# Altium schematic sheet USB3.SchDoc (part 2 of 2)
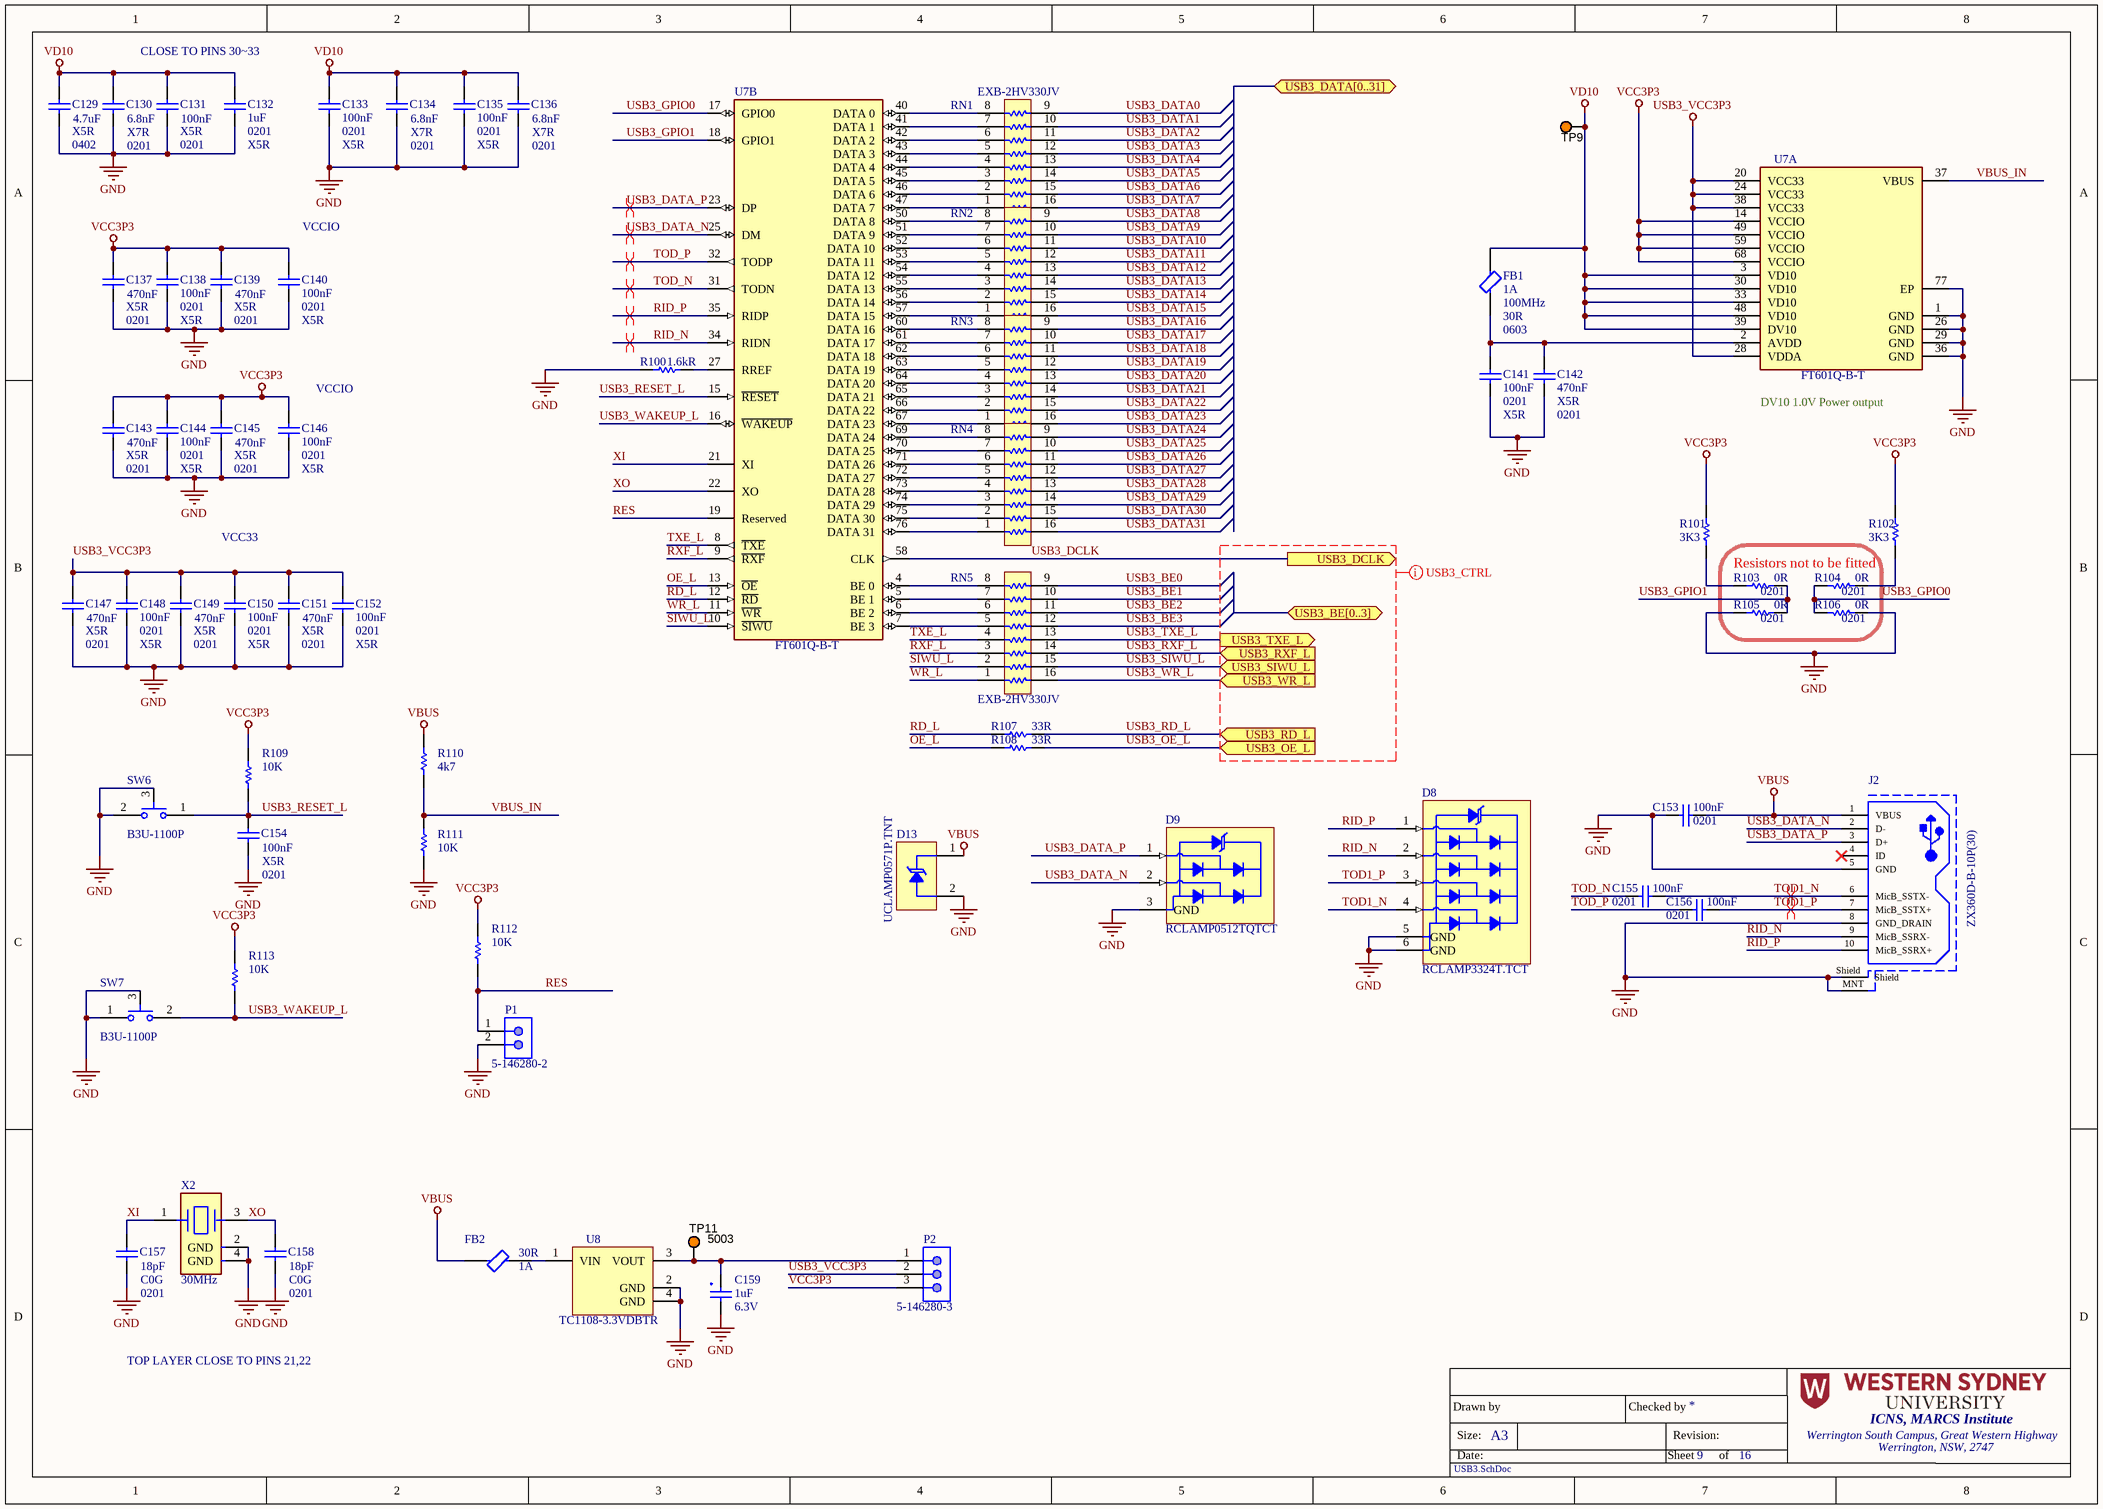
[diagram p1: USB3.SchDoc]

## Library data of the parts
C129 = CMP-003-000024-1: Cap Multilayer Ceramic 4.7uF 10 V X5R ±10 % SMT 0402  C Series; Manufacturer: TDK; Voltage Rating: 10V; Tolerance: 10%; Value: 4.7uF; ComponentLink2Description: https://datasheet.ciiva.com/14895/tdkmlcccaprange-14895671.pdf?src-supplier=Digi-Key; Manufacturer Part Number: C1005X5R1A475K050BC; Category: Ceramic Capacitors; ComponentLink2URL: https://datasheet.ciiva.com/14895/tdkmlcccaprange-14895671.pdf?src-supplier=Digi-Key; Lead Free: Lead Free; RoHS: Yes; Thickness: 0.022inch; Package Quantity: 10000; ComponentLink1URL: https://datasheet.ciiva.com/14895/tdkmlcccaprange-14895670.pdf?src-supplier=Digi-Key; ComponentLink3Description: https://datasheet.ciiva.com/14895/tdkmlcccaprange-14895672.pdf?src-supplier=Digi-Key; Case/Package: 0402; REACH SVHC: No SVHC; ComponentLink1Description: https://datasheet.ciiva.com/14895/tdkmlcccaprange-14895670.pdf?src-supplier=Digi-Key; Length: 0.039inch; Max Operating Temperature: 85°C; Series: C; ComponentLink3URL: https://datasheet.ciiva.com/14895/tdkmlcccaprange-14895672.pdf?src-supplier=Digi-Key; Voltage Rating (DC): 10V; Min Operating Temperature: -55°C; Width: 0.02inch; Stock 1: 490145; Source: ICNS_PropheseeLib.SchLib; Pricing 1: 1=0.48000, 10=0.33000, 50=0.23100, 100=0.19800, 500=0.14850, 1000=0.12540, 2500=0.11880, 5000=0.11220 (USD); Design Item ID: C1005X5R1A475K050BC; Dielectric Material: Ceramic; Mount: Surface Mount; Packaging: Cut Tape; Case Code (Metric): 1005
C130 C134 C136 = CMP-003-000023-2: Cap Multilayer Ceramic 6.8nF 10V X7R SMT 0201 ±10% Tolerance; Manufacturer: Murata; Voltage Rating: 10V; Value: 6.8nF; Tolerance: 10%; Max Operating Temperature: 125°C; Case/Package: 0201; Min Operating Temperature: -55°C; ComponentLink9URL: https://datasheet.ciiva.com/11619/product-11619829.pdf?src-supplier=Avnet; ComponentLink9Description: https://datasheet.ciiva.com/11619/product-11619829.pdf?src-supplier=Avnet; Manufacturer Part Number: GRM033R71A682KA01D; ComponentLink7Description: https://datasheet.ciiva.com/6068/482872-6068141.pdf?src-supplier=Farnell; Depth: 0.3mm; ComponentLink7URL: https://datasheet.ciiva.com/6068/482872-6068141.pdf?src-supplier=Farnell; Thickness: 0.013inch; REACH SVHC: No SVHC; ComponentLink3Description: https://datasheet.ciiva.com/130/grm033r71a682ka01-01-130329.pdf?src-supplier=Digi-Key; Stock 1: 373159; Pricing 1: 1=0.10000, 10=0.02500, 50=0.01380, 100=0.01130, 500=0.00808, 1000=0.00635, 2500=0.00578, 5000=0.00531 (USD); Lead Free: Lead Free; Packaging: Tape and Reel; Length: 0.6mm; ComponentLink6Description: https://datasheet.ciiva.com/6068/482872-6068139.pdf?src-supplier=Farnell; Mount: Surface Mount; ComponentLink6URL: https://datasheet.ciiva.com/6068/482872-6068139.pdf?src-supplier=Farnell; Radiation Hardening: No; Source: ICNS_PropheseeLib.SchLib; ComponentLink2Description: https://datasheet.ciiva.com/130/grm033r71a682ka01-01-130327.pdf?src-supplier=Digi-Key; ComponentLink2URL: https://datasheet.ciiva.com/130/grm033r71a682ka01-01-130327.pdf?src-supplier=Digi-Key; Case Code (Metric): 0603; Width: 0.3mm; Termination: SMD/SMT; ComponentLink1URL: https://datasheet.ciiva.com/130/grm033r71a682ka01-01-130328.pdf?src-supplier=Digi-Key; ComponentLink1Description: https://datasheet.ciiva.com/130/grm033r71a682ka01-01-130328.pdf?src-supplier=Digi-Key; Design Item ID: GRM033R71A682KA01D; ComponentLink5URL: https://datasheet.ciiva.com/29199/455752-da-01-en-vs-kondensator-0201-29199157.pdf?src-supplier=Conrad; ComponentLink8Description: https://datasheet.ciiva.com/7937/482872-7937599.pdf?src-supplier=Element14; Voltage Rating (DC): 10V; ComponentLink8URL: https://datasheet.ciiva.com/7937/482872-7937599.pdf?src-supplier=Element14; ComponentLink4Description: https://datasheet.ciiva.com/17453/product-17453281.pdf?src-supplier=Avnet+Europe; Number of Pins: 2; Height: 0.3mm; RoHS: Yes; ComponentLink4URL: https://datasheet.ciiva.com/17453/product-17453281.pdf?src-supplier=Avnet+Europe; ComponentLink3URL: https://datasheet.ciiva.com/130/grm033r71a682ka01-01-130329.pdf?src-supplier=Digi-Key; Package Quantity: 1; ComponentLink5Description: https://datasheet.ciiva.com/29199/455752-da-01-en-vs-kondensator-0201-29199157.pdf?src-supplier=Conrad; Category: Ceramic Capacitors; Material: Ceramic
C131 C133 C135 C138 C140 C141 C144 C146 C148 C150 C152-C156 = CMP-003-000014-1: Cap Ceramic 0.1uF 10V X5R 10% Pad SMD 0201 85C T/R; Manufacturer: Samsung; Voltage Rating: 10V; Tolerance: 10%; Value: 0.1uF; ComponentLink2Description: https://datasheet.ciiva.com/26838/getdatasheetpartid-357484-26838083.pdf?src-supplier=Verical; Manufacturer Part Number: CL03A104KP3NNNC; Category: Ceramic Capacitors; ComponentLink2URL: https://datasheet.ciiva.com/26838/getdatasheetpartid-357484-26838083.pdf?src-supplier=Verical; Lead Free: Lead Free; RoHS: Yes; Thickness: 0.013inch; Package Quantity: 1; ComponentLink1URL: https://datasheet.ciiva.com/25803/cl03a104kp3nnnc-25803204.pdf?src-supplier=Digi-Key; Case/Package: 0201; ComponentLink1Description: https://datasheet.ciiva.com/25803/cl03a104kp3nnnc-25803204.pdf?src-supplier=Digi-Key; Length: 0.6mm; Max Operating Temperature: 85°C; Series: CL; Voltage Rating (DC): 10V; Min Operating Temperature: -55°C; Width: 0.012inch; Stock 1: 12175; Source: ICNS_PropheseeLib.SchLib; Pricing 1: 1=0.10000, 10=0.02900, 50=0.01600, 100=0.01300, 500=0.00932, 1000=0.00732, 2500=0.00666, 5000=0.00612 (USD); Design Item ID: CL03A104KP3NNNC; Mount: Surface Mount; Packaging: Tape and Reel; Case Code (Metric): 0603; Depth: 0.3mm; Radiation Hardening: No; Height: 0.3mm; Contact Plating: Tin; Construction: Flat
  C153 C155 C156: Dielectric: X5R
C132 = CMP-003-000015-1: Cap Ceramic 1uF 10V X5R 10% Pad SMD 0201 85C T/R; Manufacturer: Samsung; Manufacturer Part Number: CL03A105KP3NSNC; RoHS: Yes; Voltage Rating: 10V; Value: 1uF; Tolerance: 10%; Category: Ceramic Capacitors; Source: ICNS_PropheseeLib.SchLib; Mount: Surface Mount; Stock 1: 3449211; Packaging: Cut Tape; ComponentLink1Description: http://www.samsungsem.com/kr/support/product-search/mlcc/CL03A105KP3NSNC.jsp?src-supplier=Digi-Key; Case Code (Metric): 0603; Width: 0.012inch; Length: 0.024inch; Thickness: 0.013inch; Max Operating Temperature: 85°C; Design Item ID: CL03A105KP3NSNC; Case/Package: 0201; Min Operating Temperature: -55°C; Pricing 1: 10000=0.06202, 20000=0.05883 (USD); ComponentLink1URL: http://www.samsungsem.com/kr/support/product-search/mlcc/CL03A105KP3NSNC.jsp?src-supplier=Digi-Key; RoHS Compliant: Yes
C137 C139 C142 C143 C145 C147 C149 C151 = CMP-003-000027-1: Cap Multilayer Ceramic 0.47 uF 10V X5R  0201 10% RoHS  (High dielectric type); Manufacturer: Taiyo Yuden; Value: 470nF; Manufacturer Part Number: LMK063BBJ474KPLF; Category: Ceramic Capacitors; RoHS: Yes; ComponentLink1URL: http://www.farnell.com/datasheets/2820091.pdf?src-supplier=Farnell; ComponentLink1Description: http://www.farnell.com/datasheets/2820091.pdf?src-supplier=Farnell; Voltage Rating (DC): 10V; Stock 1: 12200; Source: ICNS_PropheseeLib.SchLib; Pricing 1: 1=0.22500, 25=0.09300, 100=0.07600, 250=0.06500, 500=0.05400, 1000=0.04400 (USD); Design Item ID: LMK063BBJ474KPLF; RoHS Compliant: Yes
C157 C158 = CMP-003-000016-2: Cap Ceramic 18pF 25V C0G 10% SMD 0201 125°C Paper T/R; Manufacturer: KEMET; Length: 0.024inch; Voltage Rating (DC): 25V; Thickness: 0.013inch; Max Operating Temperature: 125°C; Min Operating Temperature: -55°C; RoHS Compliant: Yes; Package Quantity: 1; Mount: Surface Mount; Case Code (Imperial): 0201; Termination: SMD/SMT; Voltage Rating: 25V; Capacitance: 18pF; Case Code (Metric): 0603; Tolerance: 10%; Packaging: Tape and Reel; Width: 0.012inch; Height: 0.3mm; ComponentLink2Description: https://search.kemet.com/component-edge/download/datasheet/C0201C180K3GACTU.pdf?src-supplier=Digi-Key; ComponentLink1URL: http://www.mouser.com/ds/2/212/KEM_C1003_C0G_SMD-1101588.pdf?src-supplier=Mouser; ComponentLink2URL: https://search.kemet.com/component-edge/download/datasheet/C0201C180K3GACTU.pdf?src-supplier=Digi-Key; Source: ICNS_PropheseeLib.SchLib; RoHS: Yes; Series: C; ComponentLink1Description: http://www.mouser.com/ds/2/212/KEM_C1003_C0G_SMD-1101588.pdf?src-supplier=Mouser; Pricing 1: 1=0.04140, 10=0.02080, 25=0.02070, 100=0.00980, 250=0.00970, 500=0.00700, 1000=0.00680, 3000=0.00660, 6000=0.00640 (USD); Stock 1: 13195; Category: Ceramic Capacitors; Manufacturer Part Number: C0201C180K3GACTU; Design Item ID: C0201C180K3GACTU
C159 = CMP-003-000029-1: Cap Tant Polymer 1uF 6.3VDC U CASE 20%( 1.1 X 0.6 X 0.55mm) Undertab SMD 1106-06 1.5 Ohm 105C T/R; Manufacturer: Kyocera AVX; ESR (Equivalent Series Resistance): 1R5; Mount: Surface Mount; Case Code (Metric): 1106; Category: Polymer Capacitors; Case Code (Imperial): 0402; Manufacturer Part Number: F380J105MUA; Case/Package: 0402; Design Item ID: F380J105MUA; RoHS: Yes; Source: ICNS_PropheseeLib.SchLib; Value: 1uF; RoHS Compliant: Yes; Voltage Rating (DC): 6.3V; Tolerance: 20%; Dielectric: Tant Polymer; Stock 1: 9935; Pricing 1: 1=0.26470, 10=0.24710, 25=0.24460, 100=0.21890, 250=0.21670, 500=0.20320, 1000=0.18950, 3000=0.18420, 6000=0.17850 (USD)
D8 = CMP-024-000001-2: TVS DIODE 3.3VWM 10.5VC; Manufacturer: Semtech; Reverse Standoff Voltage: 3.3V; Number of Bidirectional Channels: 4; Peak Pulse Current: 5A; Power Line Protection: Yes; Min Breakdown Voltage: 3.8V; Clamping Voltage: 10.5V; Peak Pulse Power: 75W; Mount: Surface Mount; Number of Pins: 6; Manufacturer Part Number: RCLAMP3324T.TCT; Max Operating Temperature: 125°C; RoHS Compliant: Yes; Category: TVS Diodes; Pricing 1: 1=0.99000, 10=0.87200, 50=0.87200, 100=0.66800, 500=0.52800, 1000=0.42300, 2500=0.38300, 5000=0.34800, 10000=0.33500 (USD); Design Item ID: RCLAMP3324T.TCT; RoHS: Yes; Packaging: Cut Tape; Min Operating Temperature: -40°C; Source: Falcon_Neuro.SchLib; Stock 1: 58192; Number of Unidirectional Channels: 4; Lead Free: Lead Free; Series: RailClamp®
D9 = CMP-024-000000-1: 8.5V Clamp 20A (1.2/50µs) Ipp Tvs Diode Surface Mount SGP1006N3T; Manufacturer: Semtech; Min Breakdown Voltage: 6.5V; Number of Bidirectional Channels: 2; Reverse Standoff Voltage: 5V; Power Line Protection: Yes; Peak Pulse Power: 170W; ComponentLink6Description: https://www.semtech.com/uploads/documents/rclamp0512tq.pdf?src-supplier=Digi-Key; ComponentLink5Description: http://www.farnell.com/datasheets/2723967.pdf?src-supplier=Newark; ComponentLink3URL: https://media.digikey.com/pdf/Data%20Sheets/Semtech%20PDFs/RCLAMP0512TQ_Rev6_12-17-15.pdf?src-supplier=Digi-Key; RoHS: Yes; Pricing 1: 1=1.03000, 25=0.92000, 50=0.82000, 100=0.71800, 250=0.65500, 500=0.59300 (USD); Stock 1: 2338; Peak Pulse Current: 20A; ComponentLink1Description: http://www.farnell.com/datasheets/2723967.pdf?src-supplier=Farnell; Max Operating Temperature: 125°C; ComponentLink5URL: http://www.farnell.com/datasheets/2723967.pdf?src-supplier=Newark; Design Item ID: RCLAMP0512TQTCT; ComponentLink3Description: https://media.digikey.com/pdf/Data%20Sheets/Semtech%20PDFs/RCLAMP0512TQ_Rev6_12-17-15.pdf?src-supplier=Digi-Key; Min Operating Temperature: -40°C; Source: Falcon_Neuro.SchLib; Packaging: Tape and Reel; ComponentLink1URL: http://www.farnell.com/datasheets/2723967.pdf?src-supplier=Farnell; Manufacturer Part Number: RCLAMP0512TQTCT; ComponentLink4Description: http://www.farnell.com/datasheets/2723967.pdf?src-supplier=Element14; ComponentLink4URL: http://www.farnell.com/datasheets/2723967.pdf?src-supplier=Element14; Category: TVS Diodes; Mount: Surface Mount; ComponentLink2URL: http://www.mouser.com/ds/2/761/down-768395.pdf?src-supplier=Mouser; Number of Pins: 3; RoHS Compliant: Yes; ComponentLink2Description: http://www.mouser.com/ds/2/761/down-768395.pdf?src-supplier=Mouser; Lead Free: Lead Free; ComponentLink6URL: https://www.semtech.com/uploads/documents/rclamp0512tq.pdf?src-supplier=Digi-Key; Clamping Voltage: 8.5V
D13 = CMP-024-000002-2: ESD Suppressor Diode TVS Uni-Dir 5V Automotive 2-Pin SGP T/R; Manufacturer: Semtech; Clamping Voltage: 15V; Peak Pulse Current: 80A; Number of Unidirectional Channels: 1; Power Line Protection: No; Min Breakdown Voltage: 6V; Number of Pins: 2; Design Item ID: UCLAMP0571P.TNT; Packaging: Tape and Reel; ComponentLink2URL: https://media.digikey.com/pdf/Data%20Sheets/~No%20Display/Semtech%20PDFs/uClamp0571P-3671P.pdf?src-supplier=Digi-Key; Max Operating Temperature: 125°C; Stock 1: 16165; RoHS: Yes; Source: Falcon_Neuro.SchLib; Reverse Standoff Voltage: 5V; ComponentLink1Description: http://www.mouser.com/ds/2/761/uclampxx71p_2-779780.pdf?src-supplier=Mouser; Min Operating Temperature: -40°C; ComponentLink1URL: http://www.mouser.com/ds/2/761/uclampxx71p_2-779780.pdf?src-supplier=Mouser; ComponentLink2Description: https://media.digikey.com/pdf/Data%20Sheets/~No%20Display/Semtech%20PDFs/uClamp0571P-3671P.pdf?src-supplier=Digi-Key; Resistor Type: Zener; Mount: Surface Mount; Pricing 1: 1=0.91000, 10=0.79900, 50=0.79900, 100=0.61300, 500=0.48400, 1000=0.38800, 2500=0.35100, 5000=0.31900, 10000=0.30700 (USD); Category: TVS Diodes; Manufacturer Part Number: UCLAMP0571P.TNT
FB1 = CMP-005-000009-1: Ferrite Beads Multi-Layer 30Ohm 100MHz 1A 0.05Ohm DCR 0603 Automotive T/R; Manufacturer: Murata; Shielding: Unshielded; Number of Circuits: 1; Tolerance: 25%; DC Resistance (DCR): 50mR; ComponentLink2URL: http://www.mouser.com/ds/2/281/c31e-522703.pdf?src-supplier=Mouser; Min Operating Temperature: -55°C; ComponentLink3Description: http://search.murata.co.jp/Ceramy/image/img/PDF/ENG/L0132S0193BLM18P.pdf?src-supplier=Avnet; Stock 1: 4110; ComponentLink4URL: https://www.murata.com/en-us/products/productdata/8796738650142/ENFA0003.pdf?src-supplier=Digi-Key; Source: ICNS_PropheseeLib.SchLib; Packaging: Tape and Reel; ComponentLink1URL: http://components.arrow.com/part/dataview/41887707S276346N2606?src-supplier=Arrow+Electronics; Pricing 1: 10=0.07400, 25=0.06700, 50=0.05900, 100=0.05200 (USD); ComponentLink3URL: http://search.murata.co.jp/Ceramy/image/img/PDF/ENG/L0132S0193BLM18P.pdf?src-supplier=Avnet; ComponentLink5URL: http://www.murata.com/en-global/products/productdata/8796733767710/S0580E.pdf?src-supplier=Digi-Key; Contact Plating: Tin,Matte; Design Item ID: BLM18PG300SH1D; RoHS: Yes; RoHS Compliant: Yes; ComponentLink4Description: https://www.murata.com/en-us/products/productdata/8796738650142/ENFA0003.pdf?src-supplier=Digi-Key; Series: EMIFIL®, BLM18P; Max DC Current: 1A; ComponentLink2Description: http://www.mouser.com/ds/2/281/c31e-522703.pdf?src-supplier=Mouser; Ratings: AEC-Q200; Mount: Surface Mount; Category: Ferrite Beads and Chips; Case Code (Metric): 1608; Termination: SMD/SMT; Width: 0.031inch; Package Quantity: 1; Height: 0.037inch; ComponentLink5Description: http://www.murata.com/en-global/products/productdata/8796733767710/S0580E.pdf?src-supplier=Digi-Key; Manufacturer Part Number: BLM18PG300SH1D; Number of Lines: 1; ComponentLink1Description: http://components.arrow.com/part/dataview/41887707S276346N2606?src-supplier=Arrow+Electronics; Case/Package: 0603; Max Operating Temperature: 125°C; Length: 1.6mm
FB2 = CMP-005-000009-1: Ferrite Beads Multi-Layer 30Ohm 100MHz 1A 0.05Ohm DCR 0603 Automotive T/R; Manufacturer: Murata; DC Resistance (DCR): 50mR; Shielding: Unshielded; Tolerance: 25%; Number of Circuits: 1; Case/Package: 0603; ComponentLink1Description: http://components.arrow.com/part/dataview/41887707S276346N2606?src-supplier=Arrow+Electronics; ComponentLink1URL: http://components.arrow.com/part/dataview/41887707S276346N2606?src-supplier=Arrow+Electronics; ComponentLink2Description: http://www.mouser.com/ds/2/281/c31e-522703.pdf?src-supplier=Mouser; ComponentLink2URL: http://www.mouser.com/ds/2/281/c31e-522703.pdf?src-supplier=Mouser; ComponentLink3Description: http://search.murata.co.jp/Ceramy/image/img/PDF/ENG/L0132S0193BLM18P.pdf?src-supplier=Avnet; ComponentLink3URL: http://search.murata.co.jp/Ceramy/image/img/PDF/ENG/L0132S0193BLM18P.pdf?src-supplier=Avnet; ComponentLink4Description: https://www.murata.com/en-us/products/productdata/8796738650142/ENFA0003.pdf?src-supplier=Digi-Key; ComponentLink4URL: https://www.murata.com/en-us/products/productdata/8796738650142/ENFA0003.pdf?src-supplier=Digi-Key; ComponentLink5Description: http://www.murata.com/en-global/products/productdata/8796733767710/S0580E.pdf?src-supplier=Digi-Key; ComponentLink5URL: http://www.murata.com/en-global/products/productdata/8796733767710/S0580E.pdf?src-supplier=Digi-Key; Height: 0.037inch; Length: 1.6mm; Max DC Current: 1A; Max Operating Temperature: 125°C; Min Operating Temperature: -55°C; Mount: Surface Mount; Package Quantity: 1; Packaging: Tape and Reel; Pricing 1: 10=0.07400, 25=0.06700, 50=0.05900, 100=0.05200 (USD); RoHS: Yes; Stock 1: 4110; Termination: SMD/SMT; Test Frequency: 100MHz; Width: 0.031inch; Design Item ID: BLM18PG300SH1D; RoHS Compliant: Yes; Source: ICNS_PropheseeLib.SchLib; Category: Ferrite Beads and Chips; Contact Plating: Tin,Matte; Series: EMIFIL®, BLM18P; Ratings: AEC-Q200; Case Code (Metric): 1608; Case Code (Imperial): 0603; Manufacturer Part Number: BLM18PG300SH1D; Number of Lines: 1
J2 = CMP-010-000019-1: Conn Micro USB 3.0 Type B F 10 POS 0.65mm Solder RA SMD 10 Terminal 1 Port T/R; Manufacturer: Hirose; Gender: Receptacle; Number of Contacts: 10; USB Standard: USB 3.0; Connector Type: USB; Packaging: Tape and Reel; Orientation: Right Angle; ComponentLink1URL: http://www.farnell.com/datasheets/2691175.pdf?src-supplier=Farnell; Pricing 1: 1=1.45000, 10=1.18000, 50=1.18000, 100=1.12000, 250=1.01000, 500=0.93900, 1000=0.80400, 3000=0.72800, 10000=0.72800 (USD); Stock 1: 15785; ComponentLink1Description: http://www.farnell.com/datasheets/2691175.pdf?src-supplier=Farnell; ComponentLink2URL: https://www.hirose.com/product/en/download_file/key_name/ZX360D-B-10P%2830%29/category/Specification%20Sheet/doc_file_id/87535/?file_category_id=9&item_id=02420500130&is_series=&src-supplier=Digi-Key; RoHS: Yes; ComponentLink3Description: http://www.farnell.com/datasheets/2691175.pdf?src-supplier=Newark; ComponentLink3URL: http://www.farnell.com/datasheets/2691175.pdf?src-supplier=Newark; Manufacturer Part Number: ZX360D-B-10P(30); Lead Free: Lead Free; Design Item ID: ZX360D-B-10P(30); Contact Material: Copper Alloy; Source: ICNS_PropheseeLib.SchLib; ComponentLink4Description: http://www.farnell.com/datasheets/2691175.pdf?src-supplier=Element14; Contact Plating: Gold; Category: USB Connectors; ComponentLink4URL: http://www.farnell.com/datasheets/2691175.pdf?src-supplier=Element14; REACH SVHC: Unknown; ComponentLink5URL: http://www.farnell.com/datasheets/2060516.pdf?src-supplier=Element14; ComponentLink2Description: https://www.hirose.com/product/en/download_file/key_name/ZX360D-B-10P%2830%29/category/Specification%20Sheet/doc_file_id/87535/?file_category_id=9&item_id=02420500130&is_series=&src-supplier=Digi-Key; Mount: Surface Mount,Horizontal; ComponentLink5Description: http://www.farnell.com/datasheets/2060516.pdf?src-supplier=Element14; RoHS Compliant: Yes
P1 = CMP-010-000006-1: Conn Unshrouded Header HDR 2 POS 2.54mm Solder ST Top Entry Thru-Hole Carton; Manufacturer: TE Connectivity; Current Rating: 3A; PCB Thickness: 0.063inch; Mating Connector Lock: No (Without); Keyed: No; High Temperature Housing: Yes; Contact Post Length: 0.12inch; PCB Mount Retention: Without; Number of Contacts: 2; PCB Mounting Orientation: Vertical; Approvals: CSA; Contact Current Rating: 5A; Connector Type: Plug,Header,Pin; Housing Material: Polymer; Max Operating Temperature: 105°C; ComponentLink2Description: https://datasheet.ciiva.com/734/eng-cd-146280-h-146280-1-c-dwg-734766.pdf?src-supplier=Digi-Key; Housing Color: Black; Contact Mating Length: 0.23inch; Length: 4.67mm; ComponentLink3URL: https://datasheet.ciiva.com/16397/eng-cd-146280-g2-16397754.pdf?src-supplier=Future+Electronics; Series: AMPMODU MOD II; Stabilizers: No (Without); Color: Black; Contact Shape: Square; Gasket: No (Without); Flammability Rating: UL94 V-0; Contact Type: Male Pin; Min Operating Temperature: -65°C; Row Spacing: 2.54mm; Orientation: Straight; Source: ICNS_PropheseeLib.SchLib; Selectively Loaded: No (Without); Stock 1: 23; ComponentLink1URL: https://datasheet.ciiva.com/30206/a51462802852-30206761.pdf?src-supplier=Onlinecomponents.com; ComponentLink1Description: https://datasheet.ciiva.com/30206/a51462802852-30206761.pdf?src-supplier=Onlinecomponents.com; Contact Material: Copper Alloy; Contact Protection: No (Without); Packaging: Carton; High Speed Serial Data Connector: No; Package Quantity: 500; ComponentLink2URL: https://datasheet.ciiva.com/734/eng-cd-146280-h-146280-1-c-dwg-734766.pdf?src-supplier=Digi-Key; Pricing 1: 1=0.45000, 10=0.38200, 25=0.34600, 100=0.31000, 500=0.28200, 1000=0.23200 (USD); Board Standoff: No (Without); Insulation Material: Polymer; Contact Finish - Mating: GOLD; RoHS: Yes; Termination: Through Hole; Category: Headers and Wire Housings; Number of Rows: 1; ComponentLink3Description: https://datasheet.ciiva.com/16397/eng-cd-146280-g2-16397754.pdf?src-supplier=Future+Electronics; Fastening Type: Pull; Design Item ID: 5-146280-2; Radiation Hardening: No; Contact Plating: Gold,Tin,Lead,Matte; Number of Positions: 2; Mount: Through Hole; Mating Alignment: No (Without); Pitch: 2.54mm; Depth: 2.34mm; Manufacturer Part Number: 5-146280-2; Contact Gender: Male; Insulation Color: Black
P2 = CMP-010-000011-1: PCB Breakaway Header, 0.100 in, 1 Row, 3, 0.12 in, AMPMODU Headers Series; Manufacturer: TE Connectivity; Connector Type: Plug,Header,Pin; Board Standoff: No (Without); Number of Positions: 3; Pitch: 2.54mm; PCB Mount Retention: Without; Keyed: No; Contact Post Length: 0.12inch; PCB Thickness: 0.063inch; Approvals: CSA; PCB Mounting Orientation: Vertical; High Temperature Housing: Yes; Gender: Male; Current Rating: 3A; Contact Current Rating: 5A; Termination: Through Hole; Mount: Through Hole; Color: Black; ComponentLink1URL: https://datasheet.ciiva.com/30230/a51462803853-30230238.pdf?src-supplier=Onlinecomponents.com; ComponentLink1Description: https://datasheet.ciiva.com/30230/a51462803853-30230238.pdf?src-supplier=Onlinecomponents.com; Max Operating Temperature: 105°C; Housing Color: Black; Package Quantity: 540; Source: ICNS_PropheseeLib.SchLib; ComponentLink2Description: https://datasheet.ciiva.com/1479/eng-cd-146280-g2-1479331.pdf?src-supplier=Newark; Contact Shape: Square; Category: Connectors; ComponentLink3Description: https://datasheet.ciiva.com/734/eng-cd-146280-h-146280-1-c-dwg-734768.pdf?src-supplier=Digi-Key; Housing Material: Polymer; Orientation: Straight; Radiation Hardening: No; Contact Type: Male Pin; Contact Gender: Male; ComponentLink2URL: https://datasheet.ciiva.com/1479/eng-cd-146280-g2-1479331.pdf?src-supplier=Newark; Number of Rows: 1; Contact Plating: Gold,Tin,Lead,Matte; Gasket: No (Without); Contact Mating Length: 0.23inch; Lead Free: Lead Free; Stabilizers: No (Without); Row Spacing: 2.54mm; REACH SVHC: Unknown; Design Item ID: 5-146280-3; ELV: Compliant; Depth: 2.34mm; Pricing 1: 1=0.54000, 10=0.45800, 25=0.41500, 100=0.37200, 500=0.35600, 1000=0.33900 (USD); Packaging: Carton; Contact Protection: No (Without); ComponentLink4URL: https://datasheet.ciiva.com/16397/eng-cd-146280-g2-16397734.pdf?src-supplier=Future+Electronics; Mating Alignment: No (Without); Min Operating Temperature: -65°C; Flammability Rating: UL94 V-0; ComponentLink4Description: https://datasheet.ciiva.com/16397/eng-cd-146280-g2-16397734.pdf?src-supplier=Future+Electronics; RoHS Compliant: Yes; High Speed Serial Data Connector: No; Number of Contacts: 3; Series: AMPMODU MOD II; Contact Material: Copper Alloy; ComponentLink3URL: https://datasheet.ciiva.com/734/eng-cd-146280-h-146280-1-c-dwg-734768.pdf?src-supplier=Digi-Key; Stock 1: 520; Selectively Loaded: No (Without); Mating Connector Lock: No (Without); RoHS: Yes; Manufacturer Part Number: 5-146280-3; Length: 7.21mm
R100 = CMP-006-000038-1: Res Thick Film 0201 1.6K Ohm 1% 0.05W(1/20W) ±200ppm/C Pad SMD Automotive T/R; Manufacturer: Panasonic; Voltage Rating: 25V; Temperature Coefficient: 200ppm/°C; Max Power Dissipation: 50mW; Value: 1K6; Voltage Rating (DC): 25V; REACH SVHC: Unknown; Number of Terminations: 2; Height: 0.01inch; Resistance Tolerance: 1%; Max Operating Temperature: 125°C; Case Code (Imperial): 0201; ComponentLink1URL: https://datasheet.ciiva.com/24127/aoa0000ce2-24127014.pdf?src-supplier=Mouser; Design Item ID: ERJ-1GNF1601C; Tolerance: 1%; Weight: 6E-06oz; Packaging: Tape and Reel; Series: ERJ; RoHS: Yes; RoHS Compliant: Yes; Case Code (Metric): 0603; Length: 0.024inch; Power Rating: 50mW; Resistor Type: Thick Film; Manufacturer Part Number: ERJ-1GNF1601C; Contact Plating: Tin,Matte; Source: ICNS_PropheseeLib.SchLib; Mount: Surface Mount; Radiation Hardening: No; Pricing 1: 1=0.10000, 10=0.06500, 100=0.02660, 1000=0.01192, 2500=0.01035, 5000=0.00855 (USD); ComponentLink2URL: https://datasheet.ciiva.com/46375/1678782-46375957.pdf?src-supplier=Element14; Number of Pins: 2; Width: 0.012inch; Category: Chip SMD Resistors; ComponentLink2Description: https://datasheet.ciiva.com/46375/1678782-46375957.pdf?src-supplier=Element14; Package Quantity: 15000; ComponentLink1Description: https://datasheet.ciiva.com/24127/aoa0000ce2-24127014.pdf?src-supplier=Mouser; Case/Package: 0201; Stock 1: 31779; Min Operating Temperature: -55°C; Termination: SMD/SMT
R101 R102 = CMP-006-000041-1: Res Thick Film 0201 3.3K Ohm 1% 1/20W ±100ppm/°C Moisture Resistant; Manufacturer: Yageo; Max Power Dissipation: 50mW; Voltage Rating: 25V; Temperature Coefficient: 200ppm/°C; Width: 0.012inch; Depth: 0.3mm; Package Quantity: 10000; Length: 0.6mm; Max Operating Temperature: 125°C; Height: 0.01inch; Military Standard: Not; Termination: SMD/SMT; Case Code (Metric): 0603; Resistance: 3.3K; Packaging: Tape and Reel; Min Operating Temperature: -55°C; Case/Package: 0201; Power Rating: 50mW; Case Code (Imperial): 0201; REACH SVHC: Unknown; Number of Terminations: 2; Tolerance: 1%; Resistance Tolerance: 1%; ComponentLink2URL: https://datasheet.ciiva.com/22698/1563626-22698524.pdf?src-supplier=Element14; Design Item ID: RC0201FR-073K3L; Resistor Type: Thick Film; Pricing 1: 10000=0.00476 (USD); Category: Chip SMD Resistors; Stock 1: 206155; RoHS Compliant: Yes; ComponentLink1Description: https://datasheet.ciiva.com/14985/pyu-r-int-thick-7-14985418.pdf?src-supplier=Digi-Key; Construction: Rectangular; RoHS: Yes; Source: ICNS_PropheseeLib.SchLib; ComponentLink1URL: https://datasheet.ciiva.com/14985/pyu-r-int-thick-7-14985418.pdf?src-supplier=Digi-Key; Series: RC; ComponentLink2Description: https://datasheet.ciiva.com/22698/1563626-22698524.pdf?src-supplier=Element14; Manufacturer Part Number: RC0201FR-073K3L; Features: Moisture Resistant
R103-R106 = CMP-006-000020-1: Res Thick Film 0201 0 Ohm Sulfur Resistant Pad SMD Automotive T/R; Manufacturer: Yageo; Max Power Dissipation: 50mW; Resistance: 0mR; Width: 0.012inch; Min Operating Temperature: -55°C; ComponentLink1Description: http://www.mouser.com/ds/2/447/PYu-AF_51_RoHS_L_5-1085711.pdf?src-supplier=Mouser; Stock 1: 50009; Termination: SMD/SMT; RoHS: Yes; Design Item ID: AF0201JR-070RL; ComponentLink2Description: http://www.yageo.com/documents/recent/PYu-AF_51_RoHS_L_5.pdf?src-supplier=Digi-Key; Package Quantity: 10000; Case Code (Metric): 0603; Length: 0.024inch; Weight: 6E-06oz; ComponentLink1URL: http://www.mouser.com/ds/2/447/PYu-AF_51_RoHS_L_5-1085711.pdf?src-supplier=Mouser; Case/Package: 0201; RoHS Compliant: Yes; Pricing 1: 1=0.11000, 10=0.09500, 25=0.06560, 50=0.05100, 100=0.03640, 250=0.02840, 500=0.02256, 1000=0.01602, 5000=0.01238 (USD); Height: 0.01inch; Resistor Type: Thick Film; ComponentLink2URL: http://www.yageo.com/documents/recent/PYu-AF_51_RoHS_L_5.pdf?src-supplier=Digi-Key; Source: ICNS_PropheseeLib.SchLib; Max Operating Temperature: 125°C; Number of Terminations: 2; Manufacturer Part Number: AF0201JR-070RL; Features: Moisture Resistant,Anti-Sulfur; Packaging: Tape and Reel; Category: Chip SMD Resistors
R107 R108 = CMP-006-000057-1: Res Thick Film 0402 33 Ohm 5% 0.063W(1/16W) ±200ppm/C Pad SMD Automotive T/R; Manufacturer: TE Connectivity; Max Power Dissipation: 63mW; Temperature Coefficient: 200ppm/°C; Source: ICNS_PropheseeLib.SchLib; Pricing 1: 10=0.00700, 25=0.00600, 50=0.00500, 100=0.00500 (USD); ComponentLink1Description: https://4donline.ihs.com/images/VipMasterIC/IC/TYEL/TYEL-S-A0004929575/TYEL-S-A0004929575-1.pdf?hkey=52A5661711E402568146F3353EA87419&src-supplier=Farnell; Case/Package: 0402; Features: Moisture Resistant,Automotive AEC-Q200; Case Code (Metric): 1005; Case Code (Imperial): 0402; ComponentLink1URL: https://4donline.ihs.com/images/VipMasterIC/IC/TYEL/TYEL-S-A0004929575/TYEL-S-A0004929575-1.pdf?hkey=52A5661711E402568146F3353EA87419&src-supplier=Farnell; RoHS: Yes; Packaging: Tape and Reel; Manufacturer Part Number: CRGCQ0402J33R; Stock 1: 2304; Design Item ID: CRGCQ0402J33R; Resistance: 33R; Resistor Type: Thick Film; ComponentLink3Description: https://www.te.com/commerce/DocumentDelivery/DDEController?Action=srchrtrv&DocNm=1773204-3&DocType=DS&DocLang=English&src-supplier=Digi-Key; Category: Chip SMD Resistors; RoHS Compliant: Yes; Tolerance: 5%; ComponentLink2URL: https://www.te.com/commerce/DocumentDelivery/DDEController?Action=srchrtrv&amp;DocNm=1773204-3&amp;DocType=DS&amp;DocLang=English&src-supplier=Digi-Key; Max Operating Temperature: 155°C; Number of Terminations: 2; ComponentLink2Description: https://www.te.com/commerce/DocumentDelivery/DDEController?Action=srchrtrv&amp;DocNm=1773204-3&amp;DocType=DS&amp;DocLang=English&src-supplier=Digi-Key; Min Operating Temperature: -55°C; ComponentLink3URL: https://www.te.com/commerce/DocumentDelivery/DDEController?Action=srchrtrv&DocNm=1773204-3&DocType=DS&DocLang=English&src-supplier=Digi-Key
R109 R111-R113 = CMP-006-000021-1: Res Thick Film 0201 10K Ohm 1% 0.05W(1/20W) ±200ppm/C Pad SMD Automotive T/R; Manufacturer: Yageo; Resistance: 10kR; Max Power Dissipation: 50mW; Temperature Coefficient: 200ppm/°C; Length: 0.024inch; Height: 0.01inch; Number of Terminations: 2; Min Operating Temperature: -55°C; Case Code (Metric): 0603; Case Code (Imperial): 0201; Tolerance: 1%; Max Operating Temperature: 155°C; Packaging: Tape and Reel; Width: 0.012inch; ComponentLink1URL: http://www.yageo.com/NewPortal/yageodocoutput?fileName=/pdf/R-Chip/PYu-AC_51_RoHS_L_6.pdf&src-supplier=Digi-Key; Case/Package: 0201; Source: ICNS_PropheseeLib.SchLib; Manufacturer Part Number: AC0201FR-0710KL; ComponentLink1Description: http://www.yageo.com/NewPortal/yageodocoutput?fileName=/pdf/R-Chip/PYu-AC_51_RoHS_L_6.pdf&src-supplier=Digi-Key; Category: Chip SMD Resistors; RoHS: Yes; Features: Moisture Resistant,Automotive AEC-Q200; Pricing 1: 1=0.10000, 10=0.06600, 100=0.02670, 1000=0.01201, 2500=0.01042, 5000=0.00861 (USD); Resistor Type: Thick Film; Stock 1: 698280; Design Item ID: AC0201FR-0710KL
R110 = CMP-006-000022-1: Res Thick Film 0201 4.7K Ohm 1% 1/20W ±200ppm/°C Molded SMD Paper T/R; Manufacturer: Yageo; Resistance: 4.7kR; Max Power Dissipation: 50mW; Max Operating Temperature: 155°C; Width: 0.012inch; Length: 0.024inch; Height: 0.01inch; ComponentLink1Description: http://www.yageo.com/NewPortal/yageodocoutput?fileName=/pdf/R-Chip/PYu-AC_51_RoHS_L_6.pdf&src-supplier=Digi-Key; Min Operating Temperature: -55°C; Packaging: Tape and Reel; Case Code (Metric): 0603; Case Code (Imperial): 0201; Tolerance: 1%; ComponentLink1URL: http://www.yageo.com/NewPortal/yageodocoutput?fileName=/pdf/R-Chip/PYu-AC_51_RoHS_L_6.pdf&src-supplier=Digi-Key; Number of Terminations: 2; RoHS: Yes; Temperature Coefficient: 200ppm/°C; Features: Moisture Resistant,Automotive AEC-Q200; Source: ICNS_PropheseeLib.SchLib; Case/Package: 0201; Pricing 1: 1=0.10000, 10=0.06600, 100=0.02670, 1000=0.01201, 2500=0.01042, 5000=0.00861 (USD); Stock 1: 267560; Manufacturer Part Number: AC0201FR-074K7L; Lead Free: Lead Free; Design Item ID: AC0201FR-074K7L; Category: Chip SMD Resistors; Resistor Type: Thick Film
RN1-RN5 = CMP-006-000040-1: Res Thick Film Array 33 Ohm 5% 1/4W ±200ppm/°C ISOL Molded 16-Pin 1506(8 X 0402) Convex SMD Punched Carrier T/R; Manufacturer: Panasonic; Resistance: 33R; Power Dissipation: 63mW; Voltage Rating: 25V; Power Per Element: 62.5mW; Circuit Type: Isolated; Power Rating: 250mW; Number of Contacts: 16; Voltage Rating (DC): 50V; Number of Resistors: 8; Size Code: 0402; Source: ICNS_PropheseeLib.SchLib; REACH SVHC: No SVHC; ComponentLink2URL: https://datasheet.ciiva.com/46387/1480003-46387882.pdf?src-supplier=Element14; ComponentLink3Description: https://datasheet.ciiva.com/5735/1480003-5735163.pdf?src-supplier=Farnell; ComponentLink5Description: https://datasheet.ciiva.com/28418/1790599-28418709.pdf?src-supplier=Element14; Military Standard: Not; Series: EXB; Max Operating Temperature: 125°C; Design Item ID: EXB-2HV330JV; Pricing 1: 1=0.07800, 5000=0.07400, 10000=0.06900 (USD); Radiation Hardening: No; Mount: Surface Mount; ComponentLink4Description: https://datasheet.ciiva.com/46376/1480003-46376233.pdf?src-supplier=Element14; Category: Resistor Arrays; Tolerance: 5%; RoHS: Yes; ComponentLink1URL: https://datasheet.ciiva.com/19466/923032-19466959.pdf?src-supplier=Jameco; Temperature Coefficient: 200ppm/°C; Depth: 1.6mm; Length: 3.8mm; Stock 1: 115000; ComponentLink6URL: https://datasheet.ciiva.com/28636/1790599-28636938.pdf?src-supplier=Element14; Contact Plating: Tin; Thickness: 450um; Termination: Convex; Resistance Tolerance: 5%; ComponentLink1Description: https://datasheet.ciiva.com/19466/923032-19466959.pdf?src-supplier=Jameco; Height: 0.45mm; Case Code (Metric): 1005; Case/Package: 1506; Technology: THICK FILM; RoHS Compliant: Yes; ComponentLink3URL: https://datasheet.ciiva.com/5735/1480003-5735163.pdf?src-supplier=Farnell; Manufacturer Part Number: EXB-2HV330JV; Min Operating Temperature: -55°C; Number of Pins: 16; ComponentLink7Description: https://datasheet.ciiva.com/30083/aoc0000ce1-30083868.pdf?src-supplier=Onlinecomponents.com; Width: 1.6mm; Number of Terminals/Pins: 16; ComponentLink6Description: https://datasheet.ciiva.com/28636/1790599-28636938.pdf?src-supplier=Element14; ComponentLink5URL: https://datasheet.ciiva.com/28418/1790599-28418709.pdf?src-supplier=Element14; ComponentLink7URL: https://datasheet.ciiva.com/30083/aoc0000ce1-30083868.pdf?src-supplier=Onlinecomponents.com; Lead Free: Lead Free; Packaging: Tape and Reel; Terminal Pitch: 0.5mm; Case Code (Imperial): 0402; Package Quantity: 1; ComponentLink2Description: https://datasheet.ciiva.com/46387/1480003-46387882.pdf?src-supplier=Element14; Number of Elements: 8; ComponentLink4URL: https://datasheet.ciiva.com/46376/1480003-46376233.pdf?src-supplier=Element14
SW6 SW7 = CMP-012-000002-1: Switch Tactile N.O. SPST Round Button Gull Wing 0.05A 12VDC 1.5N SMD Embossed T/R; Manufacturer: Omron; Current Rating: 50mA; Voltage Rating (DC): 12V; Electrical Life: 200000Cycles; Actuator Length: 0.4mm; Actuator Type: Standard; Switch Travel: 0.15mm; Contact Resistance: 100mR; Ratings: Dust Proof; Illumination Type: Non-Illuminated,Illuminated; Switch Function: Off-Mom; Min Operating Temperature: -25°C; Max Operating Temperature: 70°C; Throw Configuration: SPST; RoHS Compliant: Yes; Max Current Rating: 50mA; ComponentLink3URL: https://datasheet.ciiva.com/2901/b3u-1110-2901098.pdf?src-supplier=Digi-Key; ComponentLink5URL: https://datasheet.ciiva.com/22696/60838-22696216.pdf?src-supplier=Element14; Contact Plating: Silver; Design Item ID: B3U-1100P; REACH SVHC: Unknown; ComponentLink2Description: https://datasheet.ciiva.com/2901/b3u-1110-2901097.pdf?src-supplier=Digi-Key; ComponentLink9URL: https://datasheet.ciiva.com/1532/60838-1532684.pdf?src-supplier=Element14; Package Quantity: 1; Contact Current Rating: 50mA; Max Voltage Rating (DC): 12V; Mechanical Life: 200000Cycles; Length: 3.15mm; Packaging: Tape and Reel; ComponentLink8URL: https://datasheet.ciiva.com/16155/en-b3u-16155023.pdf?src-supplier=Onlinecomponents.com; ComponentLink6Description: https://datasheet.ciiva.com/14142/b3u-eng-datasheet-14142541.pdf?src-supplier=Distrelec; ComponentLink9Description: https://datasheet.ciiva.com/1532/60838-1532684.pdf?src-supplier=Element14; Source: ICNS_PropheseeLib.SchLib; ComponentLink1URL: https://datasheet.ciiva.com/1634/60838-1634404.pdf?src-supplier=Farnell; Operating Force: 1.5N; Manufacturer Part Number: B3U-1100P; Category: Tactile Switches; Series: B3U; RoHS: Yes; Lead Free: Lead Free; ComponentLink7URL: https://datasheet.ciiva.com/30197/en-b3u-30197271.pdf?src-supplier=Onlinecomponents.com; ComponentLink8Description: https://datasheet.ciiva.com/16155/en-b3u-16155023.pdf?src-supplier=Onlinecomponents.com; ComponentLink7Description: https://datasheet.ciiva.com/30197/en-b3u-30197271.pdf?src-supplier=Onlinecomponents.com; Orientation: Straight; Mount: Surface Mount; ComponentLink4Description: https://datasheet.ciiva.com/2901/b3u-1110-2901099.pdf?src-supplier=Digi-Key; ComponentLink5Description: https://datasheet.ciiva.com/22696/60838-22696216.pdf?src-supplier=Element14; ComponentLink4URL: https://datasheet.ciiva.com/2901/b3u-1110-2901099.pdf?src-supplier=Digi-Key; Weight: 0.022g; ComponentLink3Description: https://datasheet.ciiva.com/2901/b3u-1110-2901098.pdf?src-supplier=Digi-Key; Termination: SMD/SMT; Stock 1: 18128; ComponentLink2URL: https://datasheet.ciiva.com/2901/b3u-1110-2901097.pdf?src-supplier=Digi-Key; Depth: 4mm; Pricing 1: 1=1.01000, 10=0.97300, 25=0.90960, 100=0.78980, 250=0.71864, 500=0.66626, 1000=0.65502 (USD); ComponentLink6URL: https://datasheet.ciiva.com/14142/b3u-eng-datasheet-14142541.pdf?src-supplier=Distrelec; ComponentLink1Description: https://datasheet.ciiva.com/1634/60838-1634404.pdf?src-supplier=Farnell
TP9 TP11 = CMP-002-00037-2: Test Point, Orange, Height 4.6 mm, Tail Length 3 mm, 1-Pin THD, RoHS; Manufacturer: Keystone; Datasheet URL: http://keyelco.com/userAssets/file/M65p56.pdf; Datasheet Version: Jun-15; Manufacturer URL: http://www.keyelco.com/; Packaging: Bulk; Colour: Orange; Package Description: 1-Pin Through Hole Device, Dia 2.54 mm; Pins: 1; Package Reference: 5003; Case/Package: 5003; Mounting Technology: TH; Connector Type: TestPoint; Diameter: 2.54mm; Contact Material: Bronze; Package Quantity: 10; Contact Plating: Tin; RoHS Compliant: True
U7 = CMP-015-000001-1: Full Speed/High Speed/Super Speed USB 3.0 to FIFO Bridge USB 2.0/USB 3.0 3.3V Tray 76-Pin QFN EP; Manufacturer: FTDI; ComponentLink2Description: http://www.ftdichip.com/Support/Documents/DataSheets/ICs/DS_FT600Q-FT601Q%20IC%20Datasheet.pdf?src-supplier=Digi-Key; ComponentLink1Description: http://www.farnell.com/datasheets/2263949.pdf?src-supplier=Farnell; Case/Package: QFN; ComponentLink2URL: http://www.ftdichip.com/Support/Documents/DataSheets/ICs/DS_FT600Q-FT601Q%20IC%20Datasheet.pdf?src-supplier=Digi-Key; ComponentLink1URL: http://www.farnell.com/datasheets/2263949.pdf?src-supplier=Farnell; Manufacturer Part Number: FT601Q-B-T; RoHS: Yes; Packaging: Tray; RoHS Compliant: Yes; Design Item ID: FT601Q-B-T; Category: USB Interface ICs; Stock 1: 90; Min Operating Temperature: -40°C; Source: ICNS_PropheseeLib.SchLib; Max Operating Temperature: 85°C; Pricing 1: 260=8.81000 (USD)
U8 = CMP-017-000000-1: TC1108 Series 300 mA 3.3 V Fixed Output SMT CMOS LDO Regulator - SOT-223; Manufacturer: Microchip; Max Output Voltage: 3.3V; Polarity: Positive; Dropout Voltage: 240mV; Min Input Voltage: 2.7V; Accuracy: 0.5%; Number of Outputs: 1; Output Current: 300mA; Max Input Voltage: 6V; Quiescent Current: 50uA; Max Supply Voltage: 6.5V; ComponentLink1Description: https://datasheet.ciiva.com/41463/001085553-da-01-en-ic-reg-ldo-tc1108-3-3vdbtr-sot-223-3-mcp-41463238.pdf?src-supplier=Conrad; ComponentLink1URL: https://datasheet.ciiva.com/41463/001085553-da-01-en-ic-reg-ldo-tc1108-3-3vdbtr-sot-223-3-mcp-41463238.pdf?src-supplier=Conrad; RoHS: Yes; ComponentLink4URL: https://datasheet.ciiva.com/8239/21357b-8239205.pdf?src-supplier=Avnet; Number of Pins: 3; Width: 3.7mm; ComponentLink2URL: https://datasheet.ciiva.com/2056/filehandler-aspxddocname-en026002-2056224.pdf?src-supplier=Digi-Key; Manufacturer Part Number: TC1108-3.3VDBTR; Output Voltage: 3.3V; Max Operating Temperature: 125°C; Number of Regulators: 1; Length: 6.7mm; RoHS Compliant: Yes; ComponentLink4Description: https://datasheet.ciiva.com/8239/21357b-8239205.pdf?src-supplier=Avnet; Min Operating Temperature: -40°C; Pricing 1: 20=0.68400, 40=0.65000, 100=0.58600 (USD); Mount: Surface Mount; Packaging: Tape and Reel; Current Rating: 300mA; Stock 1: 1; Package Quantity: 1; Series: -; Case/Package: SOT-223-3; Lead Free: Lead Free; Termination: SMD/SMT; ComponentLink3URL: https://datasheet.ciiva.com/8237/21357b-8237896.pdf?src-supplier=Avnet; Max Output Current: 300mA; Category: Voltage Regulators - Linear; Design Item ID: TC1108-3.3VDBTR; ComponentLink3Description: https://datasheet.ciiva.com/8237/21357b-8237896.pdf?src-supplier=Avnet; Min Output Voltage: 3.3V; Nominal Output Voltage: 3.3V; REACH SVHC: No SVHC; Source: ICNS_PropheseeLib.SchLib; ComponentLink2Description: https://datasheet.ciiva.com/2056/filehandler-aspxddocname-en026002-2056224.pdf?src-supplier=Digi-Key; Height: 1.7mm; Min Supply Voltage: 2.7V; Output Type: Fixed; Radiation Hardening: No
X2 = CMP-014-000001-1: Crystal 30MHz ±10ppm (Tol) ±10ppm (Stability) 10pF FUND 40Ohm 4-Pin Ultra Mini-CSMD T/R; Manufacturer: Abracon; ESR (Equivalent Series Resistance): 40R; RoHS: Yes; Load Capacitance: 10pF; Frequency Stability: 10ppm; Packaging: Tape and Reel; Tolerance: 10ppm; Series: ABM8; Package Quantity: 1000; Depth: 2.5mm; ComponentLink1URL: https://datasheet.ciiva.com/15116/getdatasheetpartid-719799-15116710.pdf?src-supplier=Verical; Radiation Hardening: No; Height: 0.031inch; Width: 0.098inch; ComponentLink4Description: https://datasheet.ciiva.com/856/abm8-856594.pdf?src-supplier=Digi-Key; Resistor Type: Ceramic; ComponentLink3Description: https://datasheet.ciiva.com/856/abm8-856593.pdf?src-supplier=Digi-Key; Case/Package: CSMD; ComponentLink1Description: https://datasheet.ciiva.com/15116/getdatasheetpartid-719799-15116710.pdf?src-supplier=Verical; Min Operating Temperature: -10°C; ComponentLink2Description: https://datasheet.ciiva.com/856/abm8-856592.pdf?src-supplier=Digi-Key; ComponentLink2URL: https://datasheet.ciiva.com/856/abm8-856592.pdf?src-supplier=Digi-Key; ComponentLink3URL: https://datasheet.ciiva.com/856/abm8-856593.pdf?src-supplier=Digi-Key; Category: Crystals; ComponentLink4URL: https://datasheet.ciiva.com/856/abm8-856594.pdf?src-supplier=Digi-Key; Design Item ID: ABM8-30.000MHZ-10-1-U-T; Termination: SMD/SMT; Operating Frequency: 30 MHz; Lead Free: Lead Free; Source: ICNS_PropheseeLib.SchLib; Pricing 1: 1000=0.49400, 2000=0.48640, 4000=0.47880, 6000=0.35960, 8000=0.35380 (USD); Manufacturer Part Number: ABM8-30.000MHZ-10-1-U-T; Number of Pins: 4; Max Operating Temperature: 60°C; Stock 1: 6000; Frequency Tolerance: 10ppm; Mount: Surface Mount; Length: 3.2mm